# EAGLE schematic Trial (EAGLE 6.5.0)
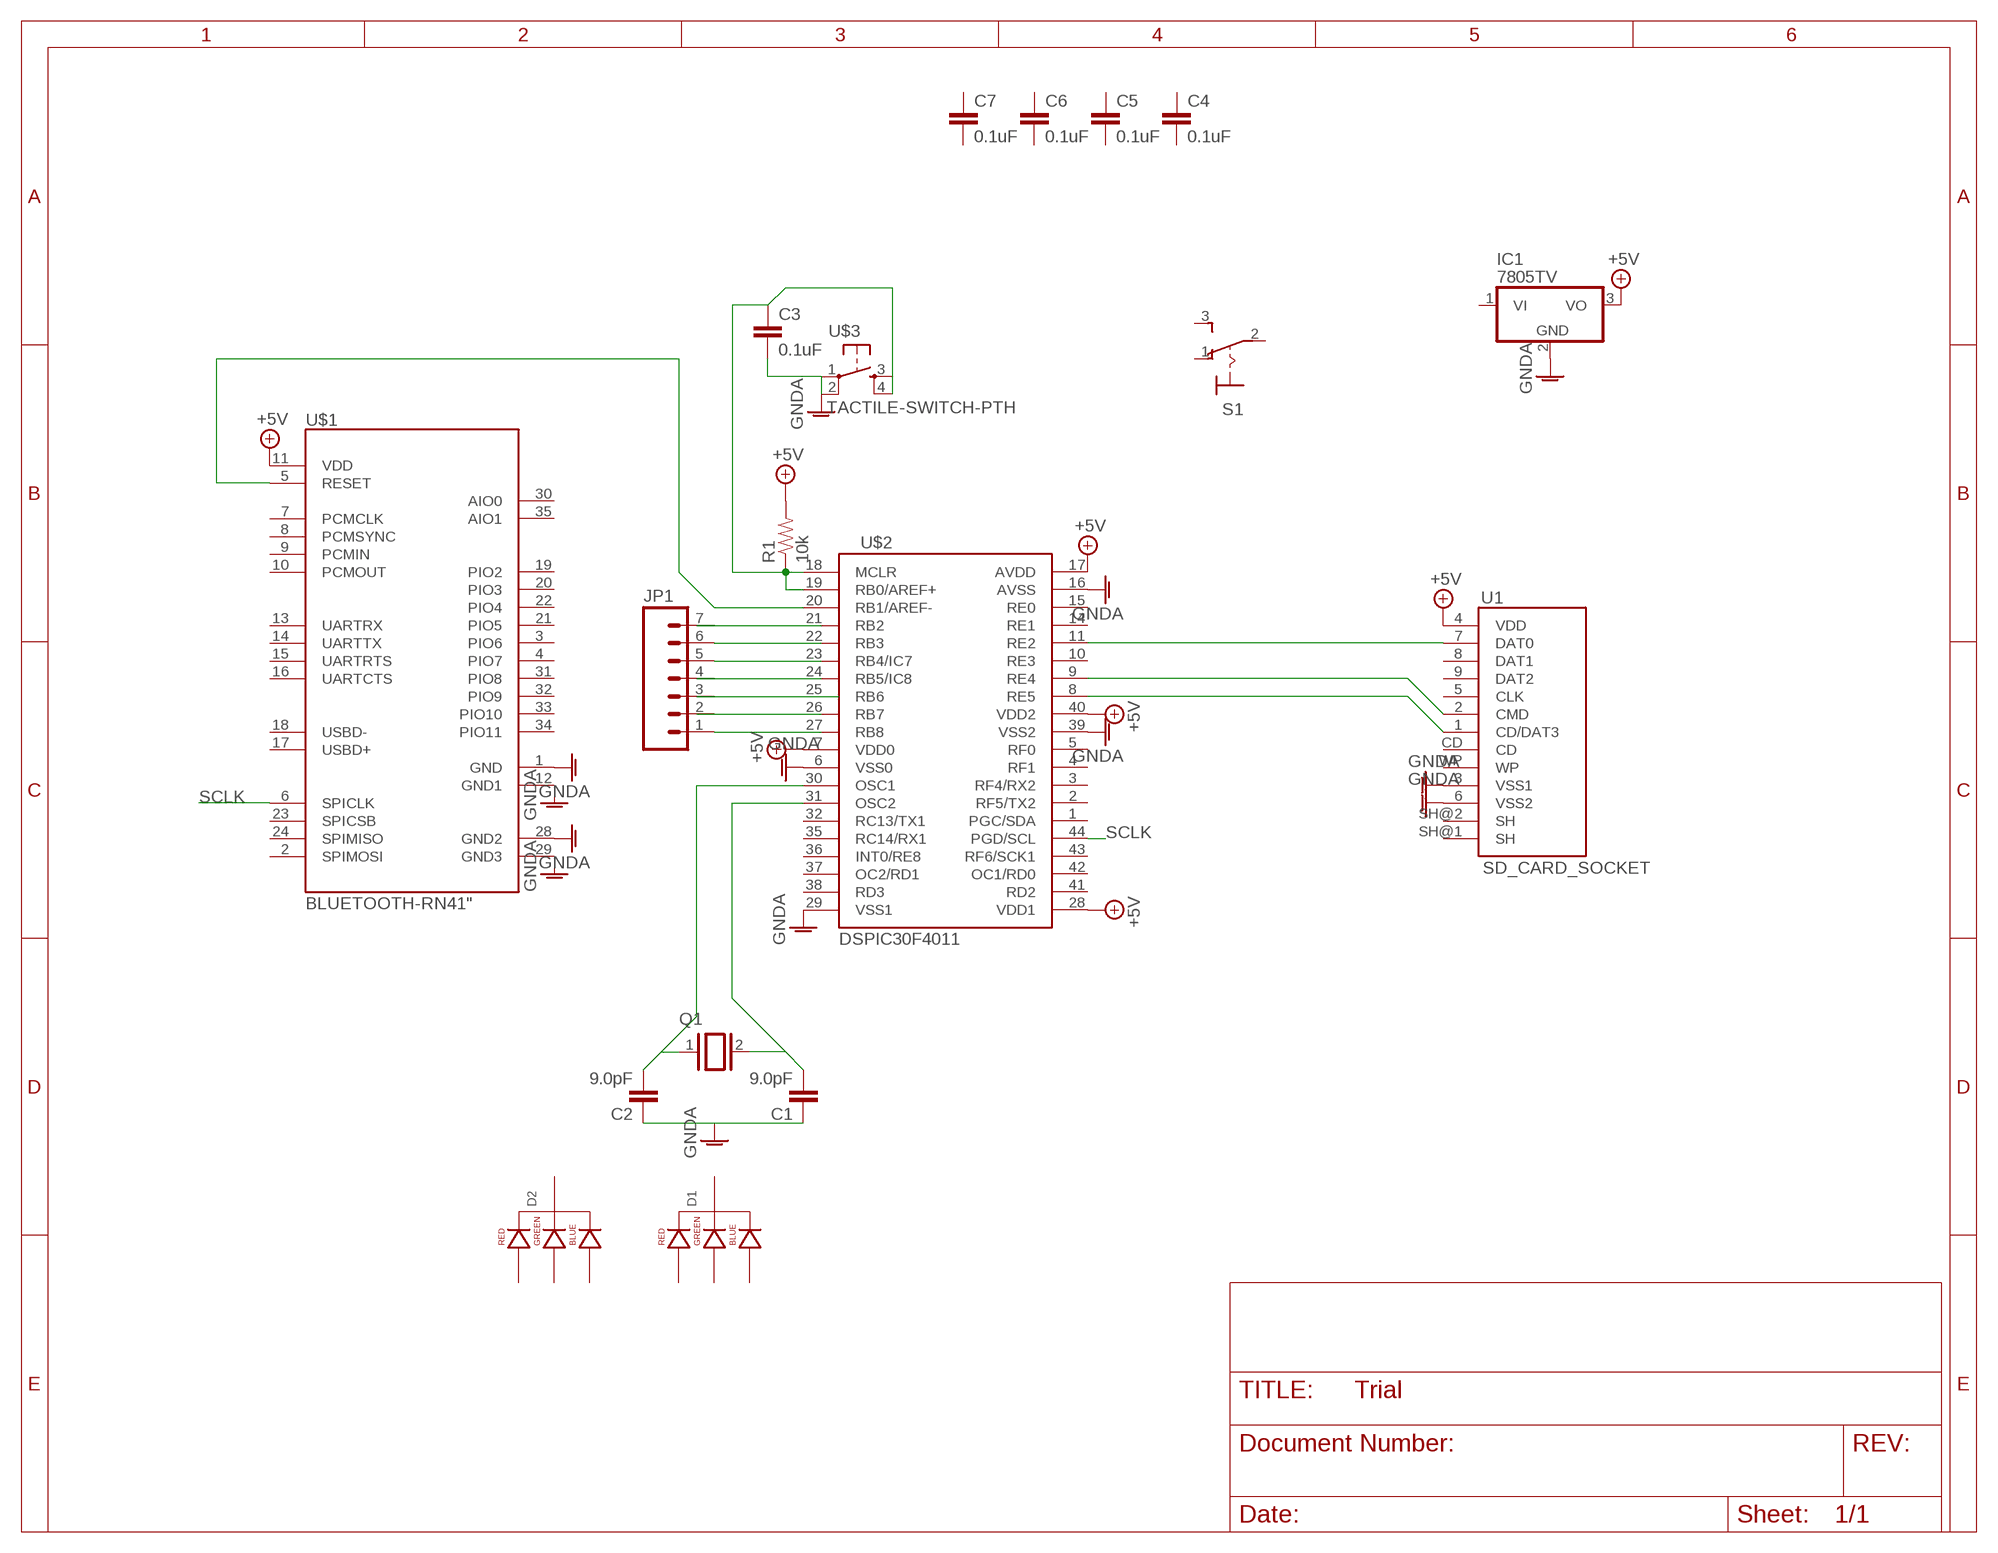
[diagram p0: schematic, sheet 1]

## Parts
C1  9.0pF  9.0PF-50V-10%(0603)  [0603-CAP]
C2  9.0pF  9.0PF-50V-10%(0603)  [0603-CAP]
C3  0.1uF  0.1UF-16V(+-10%)(0402)  [0402-CAP]
C4  0.1uF  0.1UF-16V(+-10%)(0402)  [0402-CAP]
C5  0.1uF  0.1UF-16V(+-10%)(0402)  [0402-CAP]
C6  0.1uF  0.1UF-16V(+-10%)(0402)  [0402-CAP]
C7  0.1uF  0.1UF-16V(+-10%)(0402)  [0402-CAP]
D1  LED-RGB-CC-THRUCLEAR  [LED-RGB-THRU]
D2  LED-RGB-CC-THRUCLEAR  [LED-RGB-THRU]
IC1  7805TV  [TO220V]
JP1  M07LONGPADS  [1X07_LONGPADS]
Q1  XTAL  [Q]
R1  10k  10KOHM-1/4W-1%(PTH)HORIZ  [AXIAL-0.3]
S1  320-916  [320-916]
U1  SD_CARD_SOCKET  [SD_1:1]
U$1  BLUETOOTH-RN41"  [RN41]
U$2  DSPIC30F4011  [TQFP44]
U$3  TACTILE-SWITCH-PTH  [TAC-SWITCH-PTH]

## Nets
+5V: IC1.3(VO) R1.P$2 U1.4(VDD) U$1.11(VDD) U$2.7(VDD0) U$2.17(AVDD) U$2.28(VDD1) U$2.40(VDD2)
GNDA: C1.1 C2.1 C3.2 IC1.2(GND) U1.3(VSS1) U1.6(VSS2) U$1.1(GND) U$1.12(GND1) U$1.28(GND2) U$1.29(GND3) U$2.6(VSS0) U$2.16(AVSS) U$2.29(VSS1) U$2.39(VSS2) U$3.1 U$3.2
N$1: C3.1 R1.P$1 U$2.18(MCLR) U$2.19(RB0/AREF+) U$3.3 U$3.4
N$2: U1.1(CD/DAT3) U$2.8(RE5)
N$3: U1.2(CMD) U$2.9(RE4)
N$4: U1.7(DAT0) U$2.11(RE2)
N$5: C2.2 Q1.1 U$2.30(OSC1)
N$6: C1.2 Q1.2 U$2.31(OSC2)
N$8: JP1.6
N$9: JP1.5
N$13: JP1.1
N$14: U$1.5(RESET) U$2.20(RB1/AREF-)
SCLK: U$1.6(SPICLK) U$2.44(PGD/SCL)
Unconnected: C4.1 C4.2 C5.1 C5.2 C6.1 C6.2 C7.1 C7.2 D1.1(RED_CATHODE) D1.2(CATHODE) D1.3(GREEN_CATHODE) D1.4(BLUE_CATHODE) D2.1(RED_CATHODE) D2.2(CATHODE) D2.3(GREEN_CATHODE) D2.4(BLUE_CATHODE) IC1.1(VI) JP1.2 JP1.3 JP1.4 JP1.7 S1.1(O) S1.2(P) S1.3(S) U1.5(CLK) U1.8(DAT1) U1.9(DAT2) U1.CD U1.SH@1(SH) U1.SH@2(SH) U1.WP U$1.2(SPIMOSI) U$1.3(PIO6) U$1.4(PIO7) U$1.7(PCMCLK) U$1.8(PCMSYNC) U$1.9(PCMIN) U$1.10(PCMOUT) U$1.13(UARTRX) U$1.14(UARTTX) U$1.15(UARTRTS) U$1.16(UARTCTS) U$1.17(USBD+) U$1.18(USBD-) U$1.19(PIO2) U$1.20(PIO3) U$1.21(PIO5) U$1.22(PIO4) U$1.23(SPICSB) U$1.24(SPIMISO) U$1.30(AIO0) U$1.31(PIO8) U$1.32(PIO9) U$1.33(PIO10) U$1.34(PIO11) U$1.35(AIO1) U$2.1(PGC/SDA) U$2.2(RF5/TX2) U$2.3(RF4/RX2) U$2.4(RF1) U$2.5(RF0) U$2.10(RE3) U$2.14(RE1) U$2.15(RE0) U$2.21(RB2) U$2.22(RB3) U$2.23(RB4/IC7) U$2.24(RB5/IC8) U$2.25(RB6) U$2.26(RB7) U$2.27(RB8) U$2.32(RC13/TX1) U$2.35(RC14/RX1) U$2.36(INT0/RE8) U$2.37(OC2/RD1) U$2.38(RD3) U$2.41(RD2) U$2.42(OC1/RD0) U$2.43(RF6/SCK1)

## Library data of the parts
C1 C2 = SparkFun-Capacitors:9.0PF-50V-10%(0603): CAP-09341; PROD_ID: CAP-09341
C3-C7 = SparkFun-Capacitors:0.1UF-16V(+-10%)(0402); PROD_ID: CAP-12416
D1 D2 = SparkFun-LED:LED-RGB-CC-THRU: RGB Through-hole common cathode LED SparkFun Storefront: COM-00105 (Clear) COM-09264 (Diffuse); PROD_ID: DIO-08418
IC1 = linear:78*: Positive VOLTAGE REGULATOR Source: http://cache.national.com/ds/LM/LM78L05.pdf http://www.fairchildsemi.com/ds/LM/LM7805.pdf
JP1 = SparkFun-Connectors:M07: Header 7 Standard 7-pin 0.1" header. Use with straight break away headers (SKU : PRT-00116), right angle break away headers (PRT-00553), swiss pins (PRT-00743), machine pins (PRT-00117), and female headers (PRT-00115). NOTES ON THE VARIANTS LOCK and LOCK_LONGPADS... This footprint was designed to help hold the alignment of a through-hole component (i.e. 7-pin header) while soldering it into place. You may notice that each hole has been shifted either up or down by 0.005 of an inch from it's more standard position (which is usually a perfectly straight line). This slight alteration caused the pins (the squares in the middle) to touch the edges of the holes. Because they are alternating, it causes a "brace" to hold the header in place. 0.005 has proven to be the perfect amount of "off-center" position when using our standard breakaway headers. Although looks a little odd when you look at the bare footprint, once you have a header in there, the alteration is very hard to notice. Also, if you push a header all the way into place, it is covered up entirely on the bottom side. This idea of altering the position of holes to aid alignment will be further integrated into the Sparkfun Library for other footprints. It can help hold any component with 3 or more connection pins.
Q1 = special:XTAL: CRYSTAL
R1 = SparkFun-Resistors:10KOHM-1/4W-1%(PTH): RES-12183; PROD_ID: RES-12183
S1 = switch:320-916: TOGGLE SWITCH distributor RS Components
U1 = SparkFun-Connectors:SD_CARD_SOCKET: SD Memory Card Connector, push-push normal type, CD enable, WP enable
U$1 = SparkFun-RF:BLUETOOTH-RN41: Bluetooth SMD module
U$2 = SparkFun-DigitalIC:DSPIC30F4011: Microchip 16-bit DSP for UAVv2x, not tested
U$3 = GeekAmmo:TACTILE-SWITCH: Tactile Switch 4 Pins, SPST NO